# Altium schematic sheet History.SchDoc
size A3; DocumentNumber: 1; SheetNumber: 1; SheetTotal: 5; SheetSize: A3; CheckedByDate: 2022-12-15; DrawByDate: 2022-12-15; SiteName: ESG TD Huangpu
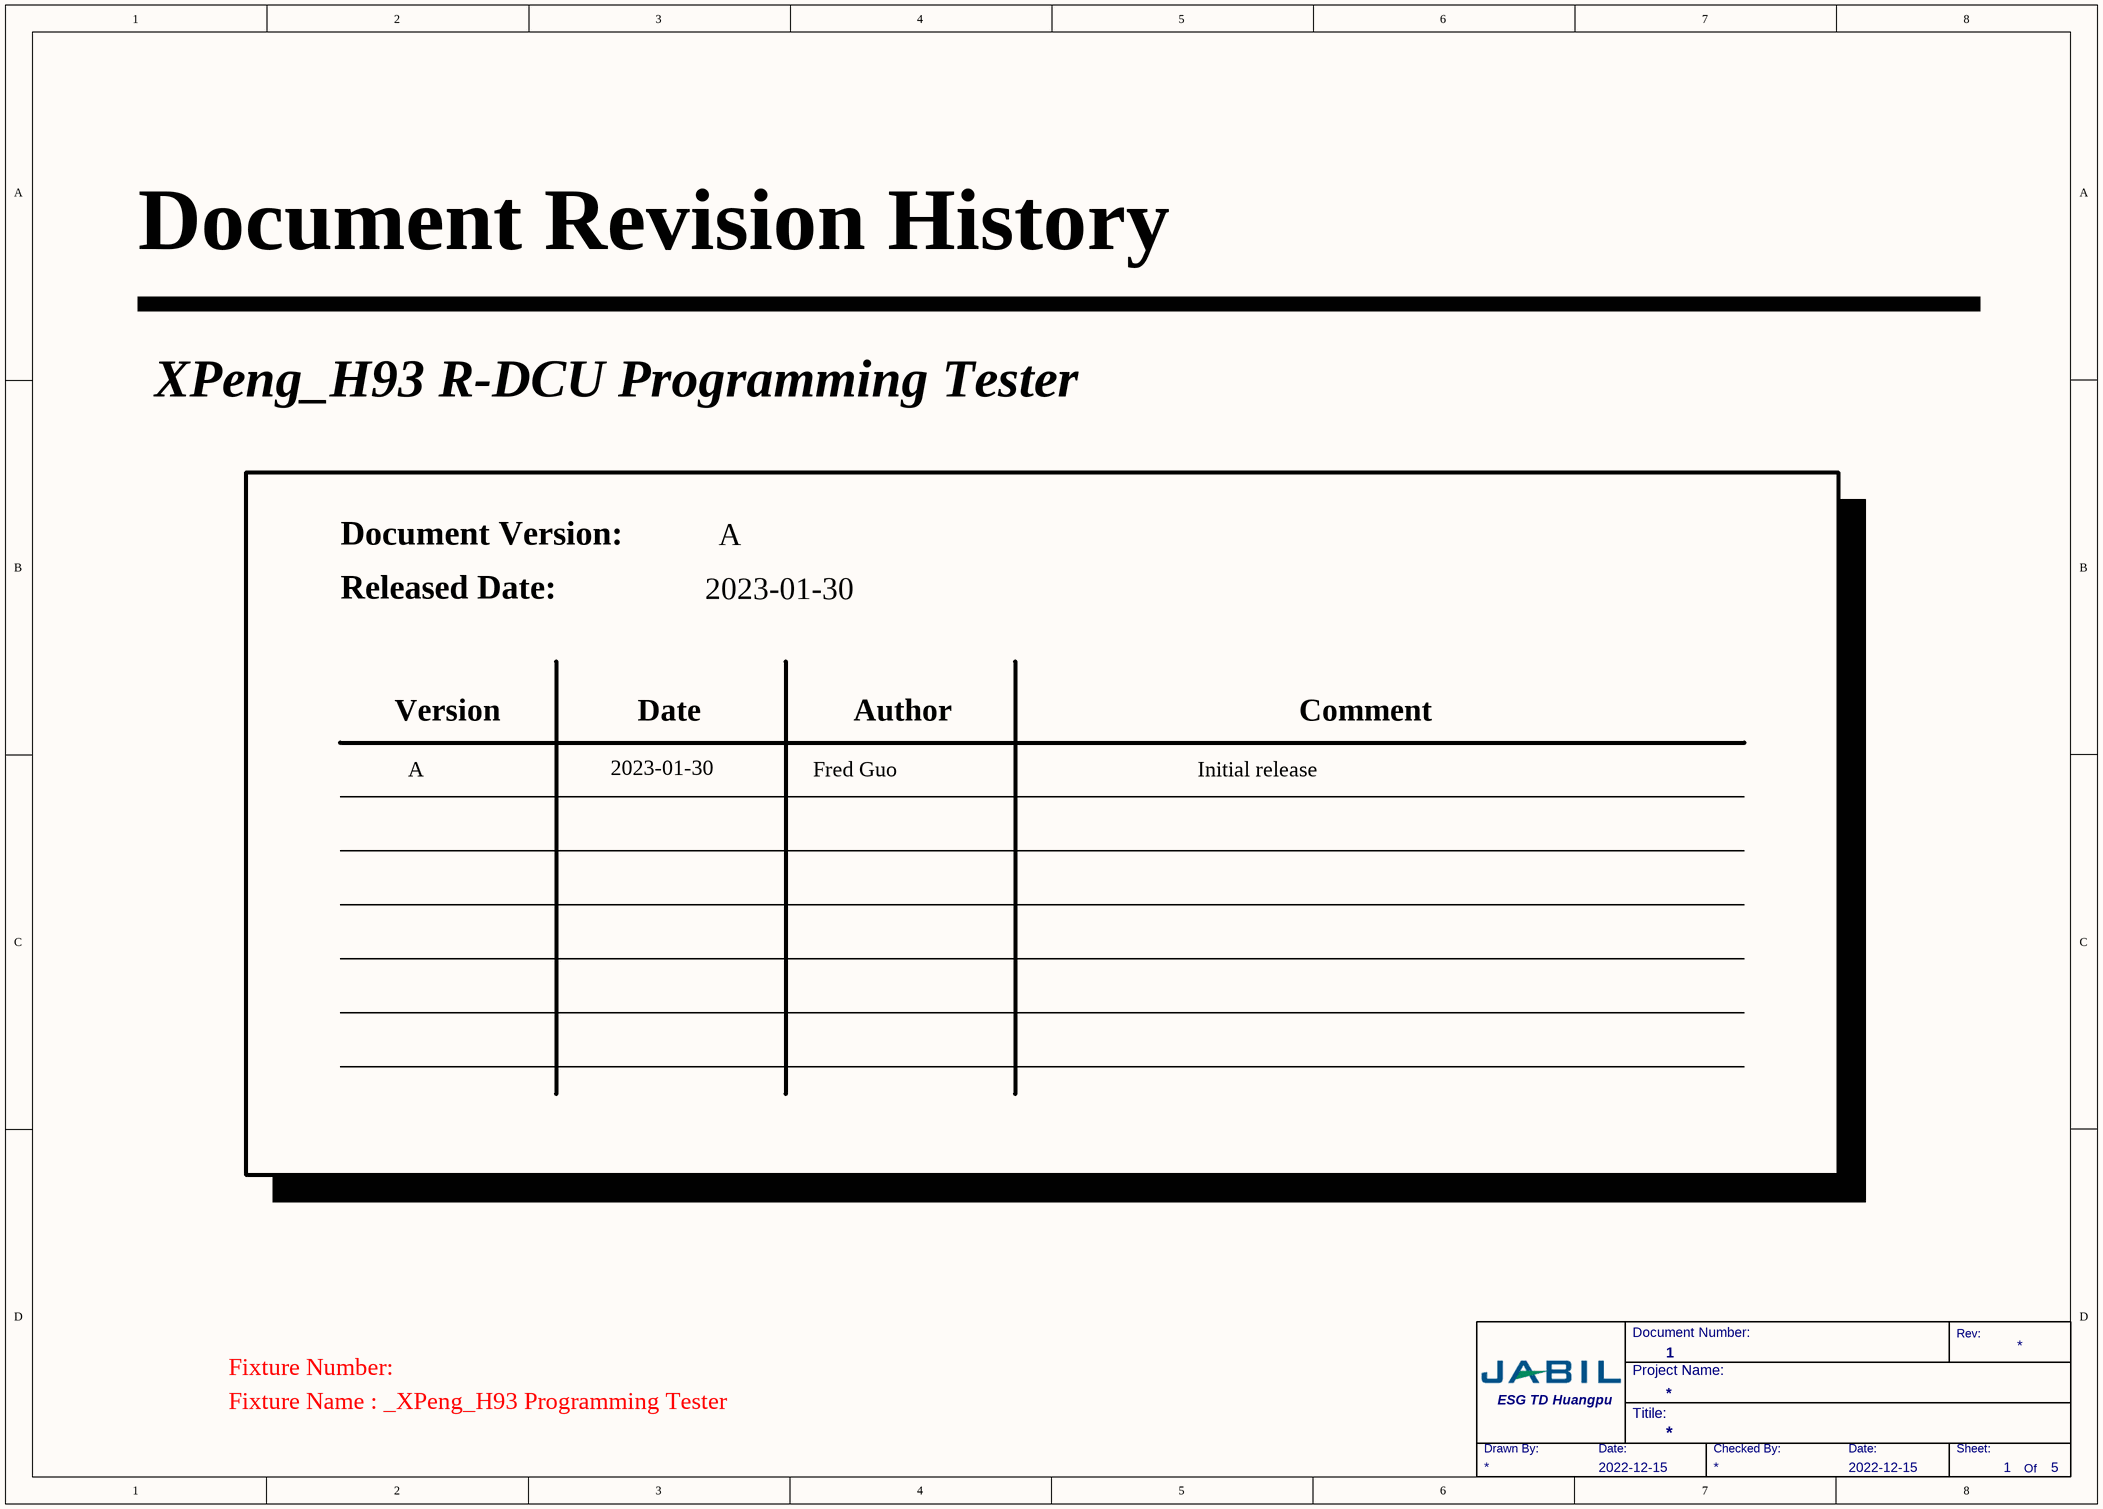
[diagram p0: History.SchDoc]

## Notes on the sheet
- Document Revision History
- XPeng_H93 R-DCU Programming Tester
- Document Version:
- A
- Released Date:
- 2023-01-30
- Version
- Date
- Fred Guo
- Author
- Initial release
- Comment
- Fixture Number:
- Fixture Name : _XPeng_H93 Programming Tester
- Document Number:
- Project Name:
- Rev:
- Drawn By:
- Date:
- Titile:
- Checked By:
- Sheet:
- Of